# EAGLE design Naked Mega I-b (EAGLE 7.3.0)
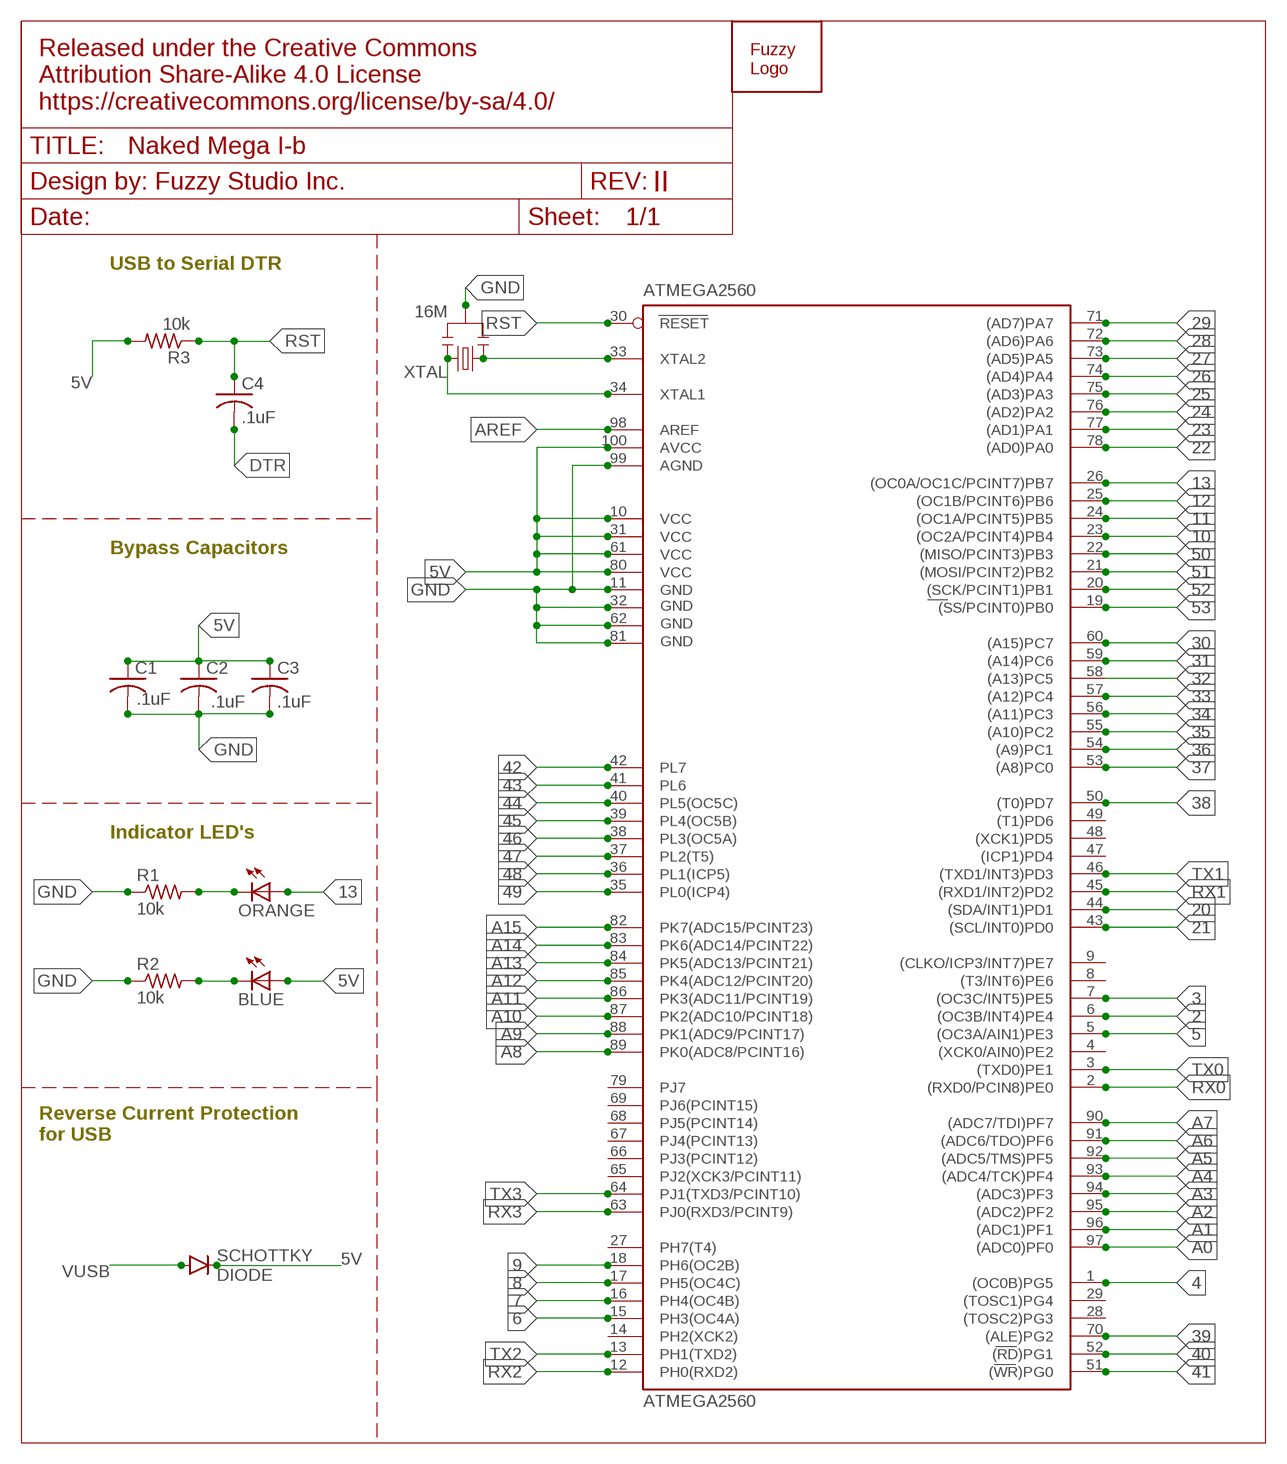
[diagram p0: schematic, sheet 1]

## Parts
ATMEGA2560  ATMEGA2560  [TQFP100]
BLUE  L  LED-SMD-0805  [SMD-0805-LED]
C1  CAPACITOR-SMD-0805  [SMD-0805]
C2  .1uF  CAPACITOR-SMD-0805  [SMD-0805]
C3  .1uF  CAPACITOR-SMD-0805  [SMD-0805]
C4  .1uF  CAPACITOR-SMD-0805  [SMD-0805]
ORANGE  L  LED-SMD-0805  [SMD-0805-LED]
R1  10k  RESISTOR-SMD-0805  [SMD-0805]
R2  10k  RESISTOR-SMD-0805  [SMD-0805]
R3  10k  RESISTOR-SMD-0805  [SMD-0805]
SCHOTTKY  DIODE  [SOD-323]
U$1  LOGO  [LOGO-S]
U$3  DOCFRAME  [CREATIVECOMMONS]
XTAL  16M  RESONATOR  [RESONATOR]

## Nets
2: ATMEGA2560.6((OC3B/INT4)PE4)
3: ATMEGA2560.7((OC3C/INT5)PE5)
4: ATMEGA2560.1((OC0B)PG5)
5: ATMEGA2560.5((OC3A/AIN1)PE3)
5V: ATMEGA2560.10(VCC) ATMEGA2560.31(VCC1) ATMEGA2560.61(VCC2) ATMEGA2560.80(VCC3) ATMEGA2560.100(AVCC) BLUE.1(A) C1.1 C2.1 C3.1 R3.2 SCHOTTKY.C
6: ATMEGA2560.15(PH3(OC4A))
7: ATMEGA2560.16(PH4(OC4B))
8: ATMEGA2560.17(PH5(OC4C))
9: ATMEGA2560.18(PH6(OC2B))
10: ATMEGA2560.23((OC2A/PCINT4)PB4)
11: ATMEGA2560.24((OC1A/PCINT5)PB5)
12: ATMEGA2560.25((OC1B/PCINT6)PB6)
13: ATMEGA2560.26((OC0A/OC1C/PCINT7)PB7) ORANGE.1(A)
20: ATMEGA2560.44((SDA/INT1)PD1)
21: ATMEGA2560.43((SCL/INT0)PD0)
22: ATMEGA2560.78((AD0)PA0)
23: ATMEGA2560.77((AD1)PA1)
24: ATMEGA2560.76((AD2)PA2)
25: ATMEGA2560.75((AD3)PA3)
26: ATMEGA2560.74((AD4)PA4)
27: ATMEGA2560.73((AD5)PA5)
28: ATMEGA2560.72((AD6)PA6)
29: ATMEGA2560.71((AD7)PA7)
30: ATMEGA2560.60((A15)PC7)
31: ATMEGA2560.59((A14)PC6)
32: ATMEGA2560.58((A13)PC5)
33: ATMEGA2560.57((A12)PC4)
34: ATMEGA2560.56((A11)PC3)
35: ATMEGA2560.55((A10)PC2)
36: ATMEGA2560.54((A9)PC1)
37: ATMEGA2560.53((A8)PC0)
38: ATMEGA2560.50((T0)PD7)
39: ATMEGA2560.70((ALE)PG2)
40: ATMEGA2560.52((RD)PG1)
41: ATMEGA2560.51((WR)PG0)
42: ATMEGA2560.42(PL7)
43: ATMEGA2560.41(PL6)
44: ATMEGA2560.40(PL5(OC5C))
45: ATMEGA2560.39(PL4(OC5B))
46: ATMEGA2560.38(PL3(OC5A))
47: ATMEGA2560.37(PL2(T5))
48: ATMEGA2560.36(PL1(ICP5))
49: ATMEGA2560.35(PL0(ICP4))
50: ATMEGA2560.22((MISO/PCINT3)PB3)
51: ATMEGA2560.21((MOSI/PCINT2)PB2)
52: ATMEGA2560.20((SCK/PCINT1)PB1)
53: ATMEGA2560.19((SS/PCINT0)PB0)
A0: ATMEGA2560.97((ADC0)PF0)
A1: ATMEGA2560.96((ADC1)PF1)
A2: ATMEGA2560.95((ADC2)PF2)
A3: ATMEGA2560.94((ADC3)PF3)
A4: ATMEGA2560.93((ADC4/TCK)PF4)
A5: ATMEGA2560.92((ADC5/TMS)PF5)
A6: ATMEGA2560.91((ADC6/TDO)PF6)
A7: ATMEGA2560.90((ADC7/TDI)PF7)
A8: ATMEGA2560.89(PK0(ADC8/PCINT16))
A9: ATMEGA2560.88(PK1(ADC9/PCINT17))
A10: ATMEGA2560.87(PK2(ADC10/PCINT18))
A11: ATMEGA2560.86(PK3(ADC11/PCINT19))
A12: ATMEGA2560.85(PK4(ADC12/PCINT20))
A13: ATMEGA2560.84(PK5(ADC13/PCINT21))
A14: ATMEGA2560.83(PK6(ADC14/PCINT22))
A15: ATMEGA2560.82(PK7(ADC15/PCINT23))
AREF: ATMEGA2560.98(AREF)
DTR: C4.2
GND: ATMEGA2560.11(GND) ATMEGA2560.32(GND1) ATMEGA2560.62(GND2) ATMEGA2560.81(GND3) ATMEGA2560.99(AGND) C1.2 C2.2 C3.2 R1.1 R2.1 XTAL.2
N$13: ATMEGA2560.34(XTAL1) XTAL.3
N$81: ATMEGA2560.33(XTAL2) XTAL.1
N$82: ORANGE.2(C) R1.2
N$83: BLUE.2(C) R2.2
RST: ATMEGA2560.30(RESET) C4.1 R3.1
RX0: ATMEGA2560.2((RXD0/PCIN8)PE0)
RX1: ATMEGA2560.45((RXD1/INT2)PD2)
RX2: ATMEGA2560.12(PH0(RXD2))
RX3: ATMEGA2560.63(PJ0(RXD3/PCINT9))
TX0: ATMEGA2560.3((TXD0)PE1)
TX1: ATMEGA2560.46((TXD1/INT3)PD3)
TX2: ATMEGA2560.13(PH1(TXD2))
TX3: ATMEGA2560.64(PJ1(TXD3/PCINT10))
VUSB: SCHOTTKY.A
Unconnected: ATMEGA2560.4((XCK0/AIN0)PE2) ATMEGA2560.8((T3/INT6)PE6) ATMEGA2560.9((CLKO/ICP3/INT7)PE7) ATMEGA2560.14(PH2(XCK2)) ATMEGA2560.27(PH7(T4)) ATMEGA2560.28((TOSC2)PG3) ATMEGA2560.29((TOSC1)PG4) ATMEGA2560.47((ICP1)PD4) ATMEGA2560.48((XCK1)PD5) ATMEGA2560.49((T1)PD6) ATMEGA2560.65(PJ2(XCK3/PCINT11)) ATMEGA2560.66(PJ3(PCINT12)) ATMEGA2560.67(PJ4(PCINT13)) ATMEGA2560.68(PJ5(PCINT14)) ATMEGA2560.69(PJ6(PCINT15)) ATMEGA2560.79(PJ7)

## Notes on the sheet
- II
- USB to Serial DTR
- Bypass Capacitors
- .1uF
- Indicator LED's
- Reverse Current Protection
  for USB

## Library data of the parts
ATMEGA2560 = Fuzzy:ATMEGA2560
BLUE ORANGE = Fuzzy:LED-SMD-0805
C1-C4 = Fuzzy:CAPACITOR-SMD-0805
R1-R3 = Fuzzy:RESISTOR-SMD-0805
SCHOTTKY = Fuzzy:DIODE
U$1 = Fuzzy:LOGO
U$3 = Fuzzy:DOCFRAME
XTAL = Fuzzy:RESONATOR

## Board
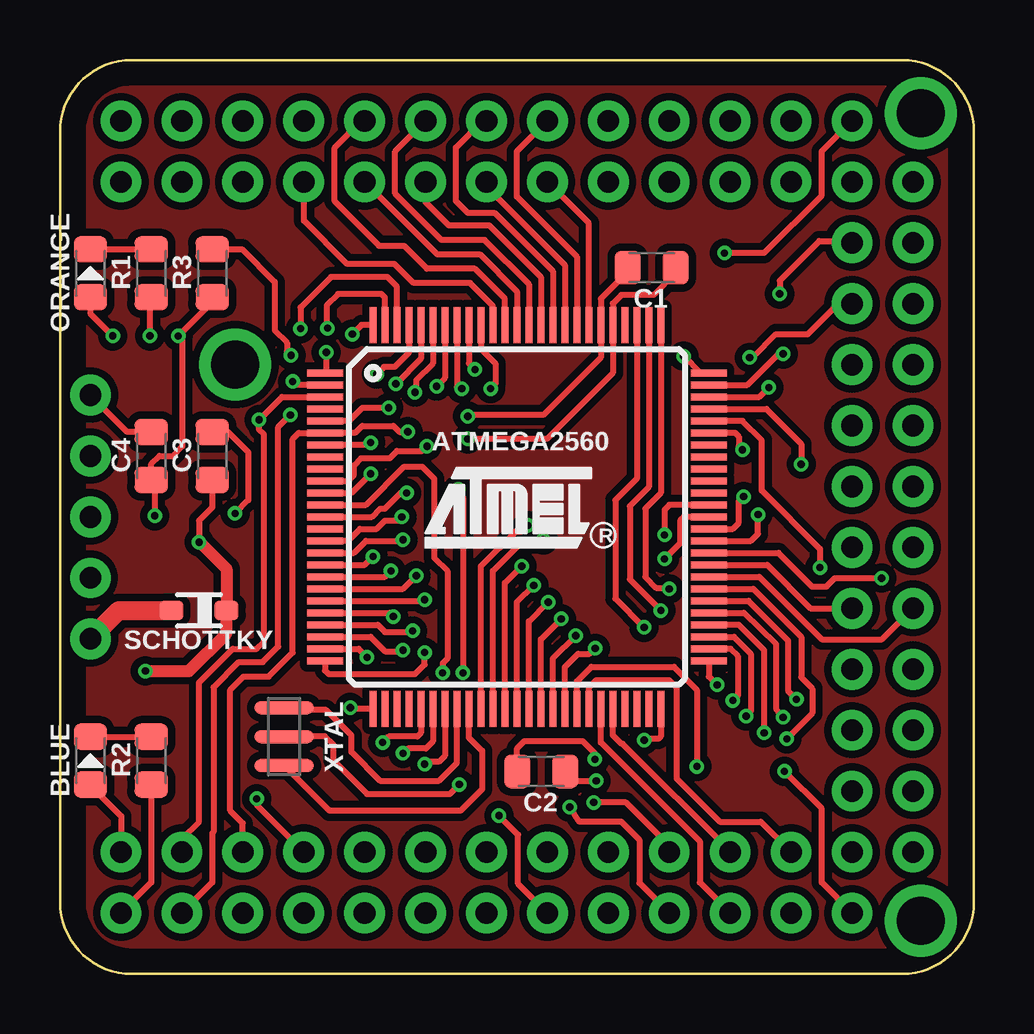
[diagram p1: board, top side]
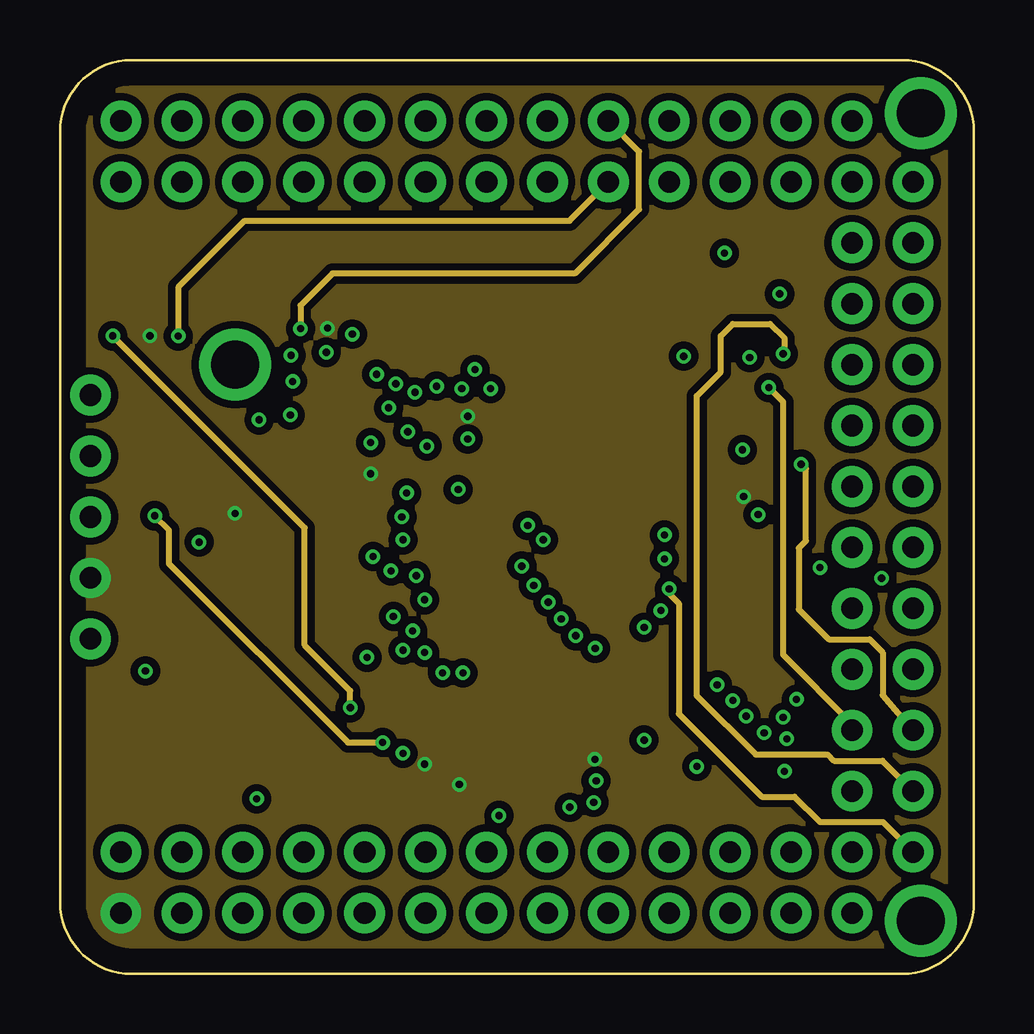
[diagram p2: board, inner layer Route2]
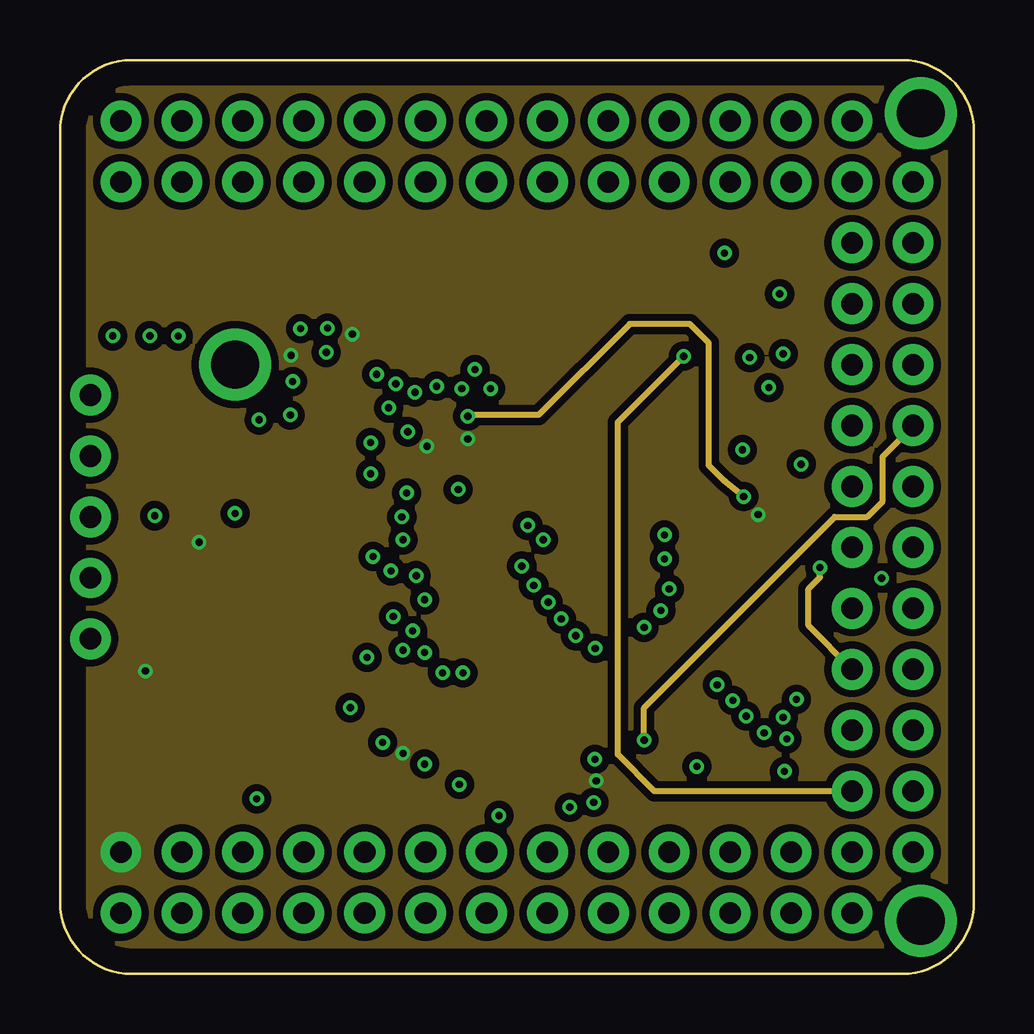
[diagram p3: board, inner layer Route15]
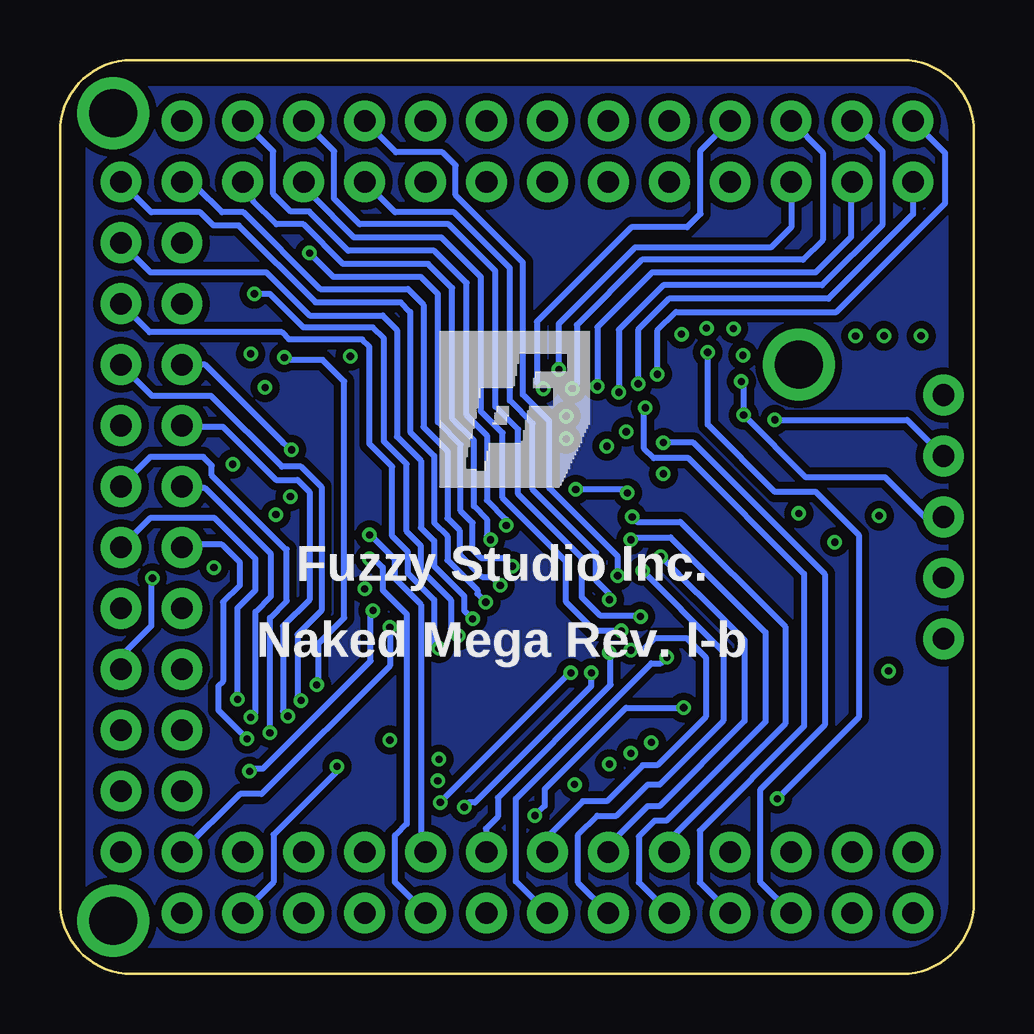
[diagram p4: board, bottom side, seen from below]

Size 38.1 x 38.1 mm. Coordinates in mm from the lower left corner, seen from the top.
Outline: 35.1,38.1 3,38.1 arc90 0,35.1 0,3 arc90 3,0 35.1,0 arc90 38.1,3 38.1,35.1 arc90 35.1,38.1
Copper layers (1*2*15*16): Top 0.035mm / dielectric 0.3mm / Route2 0.035mm / dielectric 0.3mm / Route15 0.035mm / dielectric 0.3mm / Bottom 0.035mm
Design rules "Fuzzy *": minimum track width 0.25mm, minimum drill 0.3mm, track to track 6mil, track to pad 6mil, pad to pad 6mil, via to via 6mil, smd to smd 6mil, copper to edge 40mil, drill to drill 8mil, minimum pad ring 6mil, minimum via ring 6mil, stop-mask expansion 4mil, vias tented up to drill 0.5mm, thermal gap 10mil

### Footprints (pad centres in the part's own frame; a part is rotated, then mirrored left to right if it is on the bottom)
TQFP100 = smd 1.5 x 0.3: 1 -8,6; 2 -8,5.5; 3 -8,5; 4 -8,4.5; 5 -8,4; 6 -8,3.5; 7 -8,3; 8 -8,2.5; 9 -8,2; 10 -8,1.5; 11 -8,1; 12 -8,0.5; 13 -8,0; 14 -8,-0.5; 15 -8,-1; 16 -8,-1.5; 17 -8,-2; 18 -8,-2.5; 19 -8,-3; 20 -8,-3.5; 21 -8,-4; 22 -8,-4.5; 23 -8,-5; 24 -8,-5.5; 25 -8,-6; 51 8,-6; 52 8,-5.5; 53 8,-5; 54 8,-4.5; 55 8,-4; 56 8,-3.5; 57 8,-3; 58 8,-2.5; 59 8,-2; 60 8,-1.5; 61 8,-1; 62 8,-0.5; 63 8,0; 64 8,0.5; 65 8,1; 66 8,1.5; 67 8,2; 68 8,2.5; 69 8,3; 70 8,3.5; 71 8,4; 72 8,4.5; 73 8,5; 74 8,5.5; 75 8,6 | smd 0.3 x 1.5: 26 -6,-8; 27 -5.5,-8; 28 -5,-8; 29 -4.5,-8; 30 -4,-8; 31 -3.5,-8; 32 -3,-8; 33 -2.5,-8; 34 -2,-8; 35 -1.5,-8; 36 -1,-8; 37 -0.5,-8; 38 0,-8; 39 0.5,-8; 40 1,-8; 41 1.5,-8; 42 2,-8; 43 2.5,-8; 44 3,-8; 45 3.5,-8; 46 4,-8; 47 4.5,-8; 48 5,-8; 49 5.5,-8; 50 6,-8; 76 6,8; 77 5.5,8; 78 5,8; 79 4.5,8; 80 4,8; 81 3.5,8; 82 3,8; 83 2.5,8; 84 2,8; 85 1.5,8; 86 1,8; 87 0.5,8; 88 0,8; 89 -0.5,8; 90 -1,8; 91 -1.5,8; 92 -2,8; 93 -2.5,8; 94 -3,8; 95 -3.5,8; 96 -4,8; 97 -4.5,8; 98 -5,8; 99 -5.5,8; 100 -6,8
SMD-0805-LED = smd 1.1 x 1.4: 1 -1,0; 2 1,0
SMD-0805 = smd 1.1 x 1.4: 1 -1,0; 2 1,0
SOD-323 = smd 1 x 0.8: A 1.15,0; C -1.15,0
RESONATOR = smd 0.55 x 2.5: 1 -1.2,0; 2 0,0; 3 1.2,0

### Placement (x,y rotation side)
ATMEGA2560  19.05,19.05 0 top
BLUE  1.27,8.89 90 top
C1  24.66,29.45 180 top
C2  20.06,8.44 180 top
C3  6.35,21.59 90 top
C4  3.81,21.59 90 top
ORANGE  1.27,29.21 90 top
R1  3.81,29.21 90 top
R2  3.81,8.89 90 top
R3  6.35,29.21 90 top
SCHOTTKY  5.79,15.15 180 top
U$1  22.23,20.32 0 bottom
U$3  16.5,-7 0 top  (outside the outline)
XTAL  9.34,9.89 270 top

### Tracks (layer width: path | path; a pad name or v marks a point on that pad's centre or on a via)
2  (via drill 0.3 pad 0.5, 0.9 pad 1.7)
  Top 0.25: v7.62,5.08 7.62,6.28 7.1,6.8 7.1,11.85 7.65,12.4 8.7,12.4 9.7,13.4 9.7,22.3 9.95,22.55 ATMEGA2560.6 12.3,22.55 12.6,22.85 13.9,22.85 14.15,22.6 v14.5,22.6
3  (via drill 0.3 pad 0.5, 0.9 pad 1.7)
  Top 0.25: ATMEGA2560.7 12.85,22.05 v12.95,22.15
  Bottom 0.25: 12.85,22.05 v12.95,22.15 11.7,22.15 6.22,16.67 6.22,10.38 8.9,7.7 8.9,3.82 v7.62,2.54
4  (via drill 0.3 pad 0.5, 0.9 pad 1.7)
  Top 0.25: v11.1,25.91 11.1,25.1 ATMEGA2560.1 | v8.2,7.3 8.2,7.04 v10.16,5.08
  Bottom 0.25: v11.1,25.91 11.1,22.9 8.3,20.1 6.6,20.1 4.8,18.3 4.8,10.7 v8.2,7.3
5  (via drill 0.3 pad 0.5, 0.9 pad 1.7)
  Top 0.25: v13.7,23.6 12.6,23.6 12.05,23.05 ATMEGA2560.5
  Bottom 0.25: 13.7,23.45 v13.7,23.6 13.75,23.55 13.75,21.9 13.35,21.5 11.9,21.5 7.08,16.68 7.08,10.32 11.43,5.97 11.43,3.81 v10.16,2.54
5V  (via drill 0.3 pad 0.5, 0.9 pad 1.7)
  Top 0.25: ATMEGA2560.31 15.55,9.7 15.25,9.4 14.5,9.4 v14.3,9.2 | v17,22.3 20.3,22.3 23.05,25.05 ATMEGA2560.80 23.05,27.95 23.4,28.3 24.75,28.3 25.66,29.21 C1.1 | ATMEGA2560.61 28.8,18.05 29.1,18.35 v29.1,19.15 | ATMEGA2560.10 12,20.55 12.25,20.8 12.25,21.2 12.55,21.5 13.75,21.5 14.05,21.8 15.1,21.8 v15.3,22 | R3.2 7.59,30.21 8.95,28.85 8.95,26.82 9.46,26.31 9.46,25.96 v9.63,25.79 | C3.1 6.35,19.45 5.8,18.9 v5.8,18 | C2.1 21.06,8.1 21.11,8.05 v22.35,8.05 | ATMEGA2560.100 12.57,27.05 v12.19,26.67 | BLUE.1 1.27,7.86 2.56,6.57 2.56,5.1 v2.54,5.08
  Top 0.5: 5.82,18.01 6.94,16.89 SCHOTTKY.C 6.94,14.2 5.37,12.63 v3.56,12.63
  pour Route15 (isolate 0.305): 0,35.1 0,3 arc90 3,0 35.1,0 arc90 38.1,3 38.1,35.1 arc90 35.1,38.1 3,38.1 arc90
6  (via drill 0.3 pad 0.5, 0.9 pad 1.7)
  Top 0.25: v14.25,19.05 14.1,18.9 13.55,18.9 13.2,18.55 12.5,18.55 12,18.05 ATMEGA2560.15
  Bottom 0.25: v12.7,5.08 12.7,5.6 7.87,10.43 7.87,14.48 12.24,18.85 14.05,18.85 v14.25,19.05
7  (via drill 0.3 pad 0.5, 0.9 pad 1.7)
  Top 0.25: ATMEGA2560.16 12.25,17.55 12.75,18.05 14.25,18.05 v14.3,18.1
  Bottom 0.25: v14.3,18.1 14.2,18.2 12.65,18.2 8.69,14.24 8.69,10.51 12.8,6.4 13.3,6.4 13.97,5.73 13.97,3.81 v12.7,2.54
8  (via drill 0.3 pad 0.5, 0.9 pad 1.7)
  Top 0.25: ATMEGA2560.17 12.7,17.05 v13.05,17.4
  Bottom 0.25: v15.24,5.08 15.24,5.36 13.6,7 13.1,7 9.56,10.54 9.56,13.92 11.53,15.89 11.54,15.89 v13.05,17.4
9  (via drill 0.3 pad 0.5, 0.9 pad 1.7)
  Top 0.25: ATMEGA2560.18 13.55,16.55 v13.8,16.8
  Bottom 0.25: v13.8,16.8 12.2,15.2 12.2,15.18 10.45,13.43 10.45,10.55 13.1,7.9 13.6,7.9 14.9,6.6 15.7,6.6 16.5,5.8 16.5,3.8 v15.24,2.54
10  (via drill 0.3 pad 0.5, 0.9 pad 1.7)
  Top 0.25: ATMEGA2560.23 12.95,14.05 13.55,13.45 14.25,13.45 v14.3,13.5
  Bottom 0.25: v14.3,13.5 13.8,13.5 13.3,14 11.98,14 11.18,13.2 11.18,10.72 13.2,8.7 13.8,8.7 15.3,7.2 16.3,7.2 17.8,5.7 17.8,5.1 v17.78,5.08
11  (via drill 0.3 pad 0.5, 0.9 pad 1.7)
  Top 0.25: ATMEGA2560.24 12.45,13.55 v12.8,13.2 12.75,13.15
  Bottom 0.25: v12.8,13.2 13.05,12.95 13.45,12.95 19.1,7.3 19.1,3.86 v17.78,2.54
12  (via drill 0.3 pad 0.5, 0.9 pad 1.7)
  Top 0.25: ATMEGA2560.25 11.05,12.65 11.2,12.5 14.8,12.5 15.2,12.9 v15.2,13.4
  Bottom 0.25: v15.2,13.4 15.15,13.35 15.15,12.05 19.85,7.35 19.85,6.55 20.35,6.05 20.35,5.11 v20.32,5.08
13  (via drill 0.3 pad 0.5, 0.9 pad 1.7)
  Top 0.25: v20.32,2.54 19.1,3.76 19.1,5.8 v18.3,6.6 | ORANGE.1 1.27,27.53 v2.2,26.6 | ATMEGA2560.26 12.15,11.05 v12.1,11.1
  Route2 0.25: v12.1,11.1 12.1,11.8 10.2,13.7 10.2,18.6 v2.2,26.6
  Bottom 0.25: 12.2,11.2 v12.1,11.1 14.5,11.1 17.9,7.7 17.9,7 v18.3,6.6
20  (via drill 0.9 pad 1.7)
  Top 0.25: ATMEGA2560.44 22.05,11.95 22.35,12.25 25.4,12.25 25.7,11.95 25.7,8.15 27.5,6.35 29.21,6.35 v30.48,5.08
21  (via drill 0.3 pad 0.5, 0.9 pad 1.7)
  Top 0.25: ATMEGA2560.43 21.55,12.2 22.15,12.8 25.6,12.8 26.55,11.85 v26.55,8.65
  Bottom 0.25: v26.55,8.65 26.55,8.45 29.2,5.8 29.2,3.82 v30.48,2.54
22  (via drill 0.3 pad 0.5, 0.9 pad 1.7)
  Top 0.25: ATMEGA2560.78 24.05,20.65 23.15,19.75 23.15,15.65 v24.35,14.45
  Bottom 0.25: v24.35,14.45 24.35,12.85 29.7,7.5 30.6,7.5 v33.02,5.08
23  (via drill 0.3 pad 0.5, 0.9 pad 1.7)
  Top 0.25: ATMEGA2560.77 24.55,20.3 23.75,19.5 23.75,16.45 v25.05,15.15 | v33.02,2.54 31.75,3.81 31.75,6.9 v30.2,8.45
  Bottom 0.25: v25.05,15.15 25.15,15.05 25.15,13.05 29.65,8.55 30.1,8.55 v30.2,8.45
24  (via drill 0.3 pad 0.5, 0.9 pad 1.7)
  Top 0.25: ATMEGA2560.76 25.05,20.05 24.4,19.4 24.4,16.55 24.85,16.1 25.35,16.1 v25.4,16.05
  Route2 0.25: v25.4,16.05 25.4,15.85 25.8,15.45 25.8,10.85 29.26,7.39 30.62,7.39 31.68,6.33 34.31,6.33 v35.56,5.08 35.52,5.08
25  (via drill 0.3 pad 0.5, 0.9 pad 1.7)
  Top 0.25: ATMEGA2560.75 26.7,25.05 v26,25.75
  Route15 0.25: v33.02,7.62 24.78,7.62 23.25,9.15 23.25,23 v26,25.75
26  (via drill 0.3 pad 0.5, 0.9 pad 1.7)
  Top 0.25: ATMEGA2560.74 28.65,24.55 29.95,25.85 v30.15,25.85
  Route2 0.25: v35.56,7.62 34.29,8.89 32.27,8.89 32.01,9.15 29,9.15 26.55,11.6 26.55,24.1 27.55,25.1 27.55,26.6 28.05,27.1 29.6,27.1 30.2,26.5 30.2,25.9 v30.15,25.85
27  (via drill 0.3 pad 0.5, 0.9 pad 1.7)
  Top 0.25: ATMEGA2560.73 29.15,24.05 v29.55,24.45
  Route2 0.25: v29.55,24.45 30.15,23.85 30.15,13.3 33.02,10.43 v33.02,10.16
28  (via drill 0.3 pad 0.5, 0.9 pad 1.7)
  Top 0.25: ATMEGA2560.72 29.45,23.55 30.9,22.1 v30.9,21.25
  Route2 0.25: v35.56,10.16 34.3,11.62 34.3,13.4 33.75,13.95 32.05,13.95 30.8,15.2 30.8,17.75 31.1,18.05 31.1,21.05 v30.9,21.25
29  (via drill 0.3 pad 0.5, 0.9 pad 1.7)
  Top 0.25: ATMEGA2560.71 28.45,23.05 29.25,22.25 29.25,20.15 31.68,17.72 v31.68,16.94
  Route15 0.25: v33.02,12.7 31.2,14.52 31.2,16.05 31.68,16.53 v31.68,16.94
30  (via drill 0.3 pad 0.5, 0.9 pad 1.7)
  Top 0.25: 34.2,16.45 v34.25,16.5 32.3,16.5 31.95,16.15 31.35,16.15 29.95,17.55 ATMEGA2560.60
  Bottom 0.25: v35.56,12.7 35.56,13.24 34.28,14.52 34.28,16.47 v34.25,16.5
31  (via drill 0.9 pad 1.7)
  Top 0.25: 32.98,15.2 v33.02,15.24 31.29,15.24 29.48,17.05 ATMEGA2560.59
32  (via drill 0.9 pad 1.7)
  Top 0.25: ATMEGA2560.58 29.15,16.55 31.75,13.95 34.27,13.95 v35.56,15.24
33  (via drill 0.3 pad 0.5, 0.9 pad 1.7)
  Top 0.25: ATMEGA2560.57 28.9,16.05 30.9,14.05 30.9,12.37 31.36,11.9 31.36,10.86 v30.3,9.8
  Bottom 0.25: v33.02,17.78 32.9,17.9 31.35,17.9 30.6,17.15 30.6,16.2 31.3,15.5 31.3,12.2 31.5,12 31.5,11 v30.3,9.8
34  (via drill 0.3 pad 0.5, 0.9 pad 1.7)
  Top 0.25: ATMEGA2560.56 28.7,15.55 30.35,13.9 30.35,11.8 v30.7,11.45 30.65,11.5
  Bottom 0.25: v30.7,11.45 30.7,15.25 29.95,16 29.95,17.3 31.65,19 34.34,19 v35.56,17.78
35  (via drill 0.3 pad 0.5, 0.9 pad 1.7)
  Top 0.25: ATMEGA2560.55 28.5,15.05 29.85,13.75 29.85,11.05 v30.15,10.7
  Bottom 0.25: v33.02,20.32 32.95,20.25 32.05,20.25 29.3,17.5 29.3,15.75 29.95,15.1 29.95,10.9 v30.15,10.7
36  (via drill 0.3 pad 0.5, 0.9 pad 1.7)
  Top 0.25: v29.35,10.05 29.35,13.5 28.3,14.55 ATMEGA2560.54
  Bottom 0.25: v29.35,10.05 29.35,14.85 28.65,15.55 28.65,17.7 28.69,17.7 31.77,20.78 31.77,21.19 32.13,21.55 34.33,21.55 v35.56,20.32
37  (via drill 0.3 pad 0.5, 0.9 pad 1.7)
  Top 0.25: ATMEGA2560.53 28.1,14.05 28.8,13.35 28.8,10.95 v28.6,10.75
  Bottom 0.25: v33.02,22.86 32.96,22.8 31.3,22.8 29.1,20.6 28.2,20.6 27.7,20.1 27.7,15.6 28.8,14.5 28.8,10.95 v28.6,10.75
38  (via drill 0.3 pad 0.5, 0.9 pad 1.7)
  Top 0.25: ATMEGA2560.50 25.05,9.9 24.95,9.8 24.4,9.8 v24.35,9.75
  Route15 0.25: v24.35,9.75 24.35,11.1 32.3,19.05 33.65,19.05 34.3,19.7 34.3,21.56 35.56,22.82 v35.56,22.86
39  (via drill 0.3 pad 0.5, 0.9 pad 1.7)
  Top 0.25: v28.45,21.85 28.3,22 28.3,22.4 28.15,22.55 ATMEGA2560.70
  Bottom 0.25: v28.45,21.85 28.8,22.15 32.05,25.4 v33.02,25.4
40  (via drill 0.3 pad 0.5, 0.9 pad 1.7)
  Top 0.25: v28.05,11.4 28.25,11.6 28.25,13.25 27.95,13.55 ATMEGA2560.52
  Bottom 0.25: v35.56,25.4 34.26,24.1 31.8,24.1 28.85,21.15 28.05,21.15 27.2,20.3 27.2,15.15 28.2,14.15 28.2,11.55 v28.05,11.4
41  (via drill 0.3 pad 0.5, 0.9 pad 1.7)
  Top 0.25: ATMEGA2560.51 27.05,12.4 v27.4,12.05 | v33.02,27.94 32.44,27.94 31.17,26.67 29.84,26.67 28.88,25.7 v28.75,25.7
  Bottom 0.25: v27.4,12.05 27.35,12.1 27.35,13.75 26.25,14.85 26.25,24.7 27.15,25.6 28.65,25.6 v28.75,25.7
42  (via drill 0.3 pad 0.5, 0.9 pad 1.7)
  Top 0.25: ATMEGA2560.42 21.05,12.79 21.6,13.34 22.08,13.34 v22.31,13.57
  Bottom 0.25: v35.56,27.94 34.37,26.75 28.85,26.75 28.55,26.45 25.5,26.45 25.2,26.15 25.2,22.1 24.25,21.15 24.25,18.25 23.6,17.6 23.6,16.7 22.5,15.6 22.5,13.76 v22.31,13.57
43  (via drill 0.3 pad 0.5, 0.9 pad 1.7)
  Top 0.25: ATMEGA2560.41 20.55,13.15 v21.5,14.1 21.45,14.05 | v33.02,30.48 32.95,30.55 31.65,30.55 30,28.9 v30,28.35
  Bottom 0.25: v30,28.35 29.35,28.35 27.95,26.95 25.05,26.95 24.6,26.5 24.6,22.2 23.65,21.25 23.65,18.45 23.05,17.85 23.05,16.85 21.8,15.6 21.8,14.4 v21.5,14.1
44  (via drill 0.3 pad 0.5, 0.9 pad 1.7)
  Top 0.25: ATMEGA2560.40 20.05,13.95 v20.9,14.8 20.85,14.75
  Bottom 0.25: v20.9,14.8 21.25,15.15 21.25,15.75 22.5,17 22.5,18.05 23.05,18.6 23.05,21.4 24.05,22.4 24.05,26.85 24.65,27.45 27.7,27.45 29.5,29.25 34.33,29.25 v35.56,30.48
45  (via drill 0.3 pad 0.5, 0.9 pad 1.7)
  Top 0.25: ATMEGA2560.39 19.55,14.7 v20.35,15.5
  Bottom 0.25: v35.56,33.02 34.29,31.75 32.25,31.75 31.7,31.2 30.65,31.2 27.45,28 23.9,28 23.5,27.6 23.5,22.6 22.5,21.6 22.5,18.8 21.95,18.25 21.95,17.25 20.7,16 20.7,15.85 v20.35,15.5
46  (via drill 0.3 pad 0.5, 0.9 pad 1.7)
  Top 0.25: ATMEGA2560.38 19.05,15.5 v19.75,16.2
  Bottom 0.25: 32.9,32.9 v33.02,33.02 32.8,32.8 32.4,32.8 31.35,31.75 30.45,31.75 27.25,28.55 23.6,28.55 22.95,27.9 22.95,22.8 21.95,21.8 21.95,19 21.45,18.5 21.45,17.5 20.5,16.55 20.1,16.55 v19.75,16.2
47  (via drill 0.3 pad 0.5, 0.9 pad 1.7)
  Top 0.25: ATMEGA2560.37 18.55,16.3 v19.25,17 | v33.02,35.56 31.75,34.29 31.75,32.45 29.35,30.05 v27.7,30.05
  Bottom 0.25: v27.7,30.05 26.7,29.05 23.05,29.05 22.35,28.35 22.35,23 21.4,22.05 21.4,19.3 20.9,18.8 20.9,17.7 20.55,17.35 19.6,17.35 v19.25,17
48  (via drill 0.3 pad 0.5, 0.9 pad 1.7)
  Top 0.25: ATMEGA2560.36 18.05,16.8 19.2,17.95 20,17.95 v20.15,18.1
  Bottom 0.25: v20.15,18.1 20.3,18.25 20.3,18.95 20.85,19.5 20.85,22.25 21.75,23.15 21.75,28.6 22.75,29.6 26.3,29.6 27.95,31.25 29.07,31.25 30.06,32.24 30.06,32.6 v30.48,33.02
49  (via drill 0.3 pad 0.5, 0.9 pad 1.7)
  Top 0.25: ATMEGA2560.35 17.55,17 19,18.45 19.25,18.45 v19.5,18.7
  Bottom 0.25: v19.5,18.7 19.5,18.95 20.3,19.75 20.3,22.45 21.15,23.3 21.15,28.8 22.5,30.15 26.08,30.15 27.71,31.78 28.48,31.78 29.21,32.51 29.21,34.29 v30.48,35.56
50  (via drill 0.3 pad 0.5, 0.9 pad 1.7)
  Top 0.25: ATMEGA2560.22 13.25,14.55 13.55,14.25 14.65,14.25 v14.7,14.3
  Bottom 0.25: v14.7,14.3 15.8,14.3 17,15.5 17,17.2 19.65,19.85 19.65,22.55 20.55,23.45 20.55,29.05 22.2,30.7 25.84,30.7 27.64,32.5 27.64,32.72 v27.94,33.02
51  (via drill 0.3 pad 0.5, 0.9 pad 1.7)
  Top 0.25: 13.8,15 v13.9,14.9 13.75,15.05 ATMEGA2560.21
  Bottom 0.25: 27.94,35.54 v27.94,35.56 26.67,34.29 26.68,34.28 26.68,32.32 25.61,31.25 21.9,31.25 19.95,29.3 19.95,23.65 19,22.7 19,20 16.35,17.35 16.35,15.7 15.6,14.95 13.95,14.95 v13.9,14.9
52  (via drill 0.3 pad 0.5, 0.9 pad 1.7)
  Top 0.25: 15.1,15.5 v15.2,15.6 15.15,15.55 ATMEGA2560.20
  Bottom 0.25: v15.2,15.6 15.2,15.85 15.75,16.4 15.75,17.55 18.4,20.2 18.4,22.95 19.35,23.9 19.35,29.43 21.67,31.75 24.13,31.75 v25.4,33.02
53  (via drill 0.3 pad 0.5, 0.9 pad 1.7)
  Top 0.25: ATMEGA2560.19 14.3,16.05 v14.85,16.6
  Bottom 0.25: v14.85,16.6 14.85,17.4 17.7,20.25 17.7,23.05 18.8,24.15 18.8,29.66 21.61,32.47 21.61,33.71 22.15,34.25 24.09,34.25 v25.4,35.56
A0  (via drill 0.3 pad 0.5, 0.9 pad 1.7)
  Top 0.25: ATMEGA2560.97 14.55,25.9 13.95,25.3 13.5,25.3 v13.2,25
  Bottom 0.25: v2.54,35.56 1.2,34.22 1.2,32.13 5.73,27.6 12.42,27.6 13.21,26.81 v13.21,25.01 v13.2,25
A1  (via drill 0.3 pad 0.5, 0.9 pad 1.7)
  Top 0.25: ATMEGA2560.96 15.05,25.65 v14,24.6
  Bottom 0.25: v2.54,33.02 2.54,31.67 6.06,28.15 12.71,28.15 14,26.86 v14,24.6 v14.01,24.61
A2  (via drill 0.3 pad 0.5, 0.9 pad 1.7)
  Top 0.25: ATMEGA2560.95 15.55,25.45 14.85,24.75 14.85,24.3 v14.8,24.25
  Bottom 0.25: v5.08,35.56 3.8,34.28 3.8,31.24 6.33,28.71 12.95,28.71 14.8,26.86 v14.8,24.25
A3  (via drill 0.3 pad 0.5, 0.9 pad 1.7)
  Top 0.25: ATMEGA2560.94 16.05,24.85 v15.7,24.5
  Bottom 0.25: v5.08,33.02 5.13,32.97 5.13,30.72 6.61,29.24 13.42,29.24 15.7,26.96 v15.7,24.5
A4  (via drill 0.3 pad 0.5, 0.9 pad 1.7)
  Top 0.25: ATMEGA2560.93 16.55,24.45 v16.75,24.4
  Bottom 0.25: v7.62,35.56 6.3,34.24 6.3,30.6 7.13,29.77 13.83,29.77 ATMEGA2560.93 16.55,24.6 v16.75,24.4
A5  (via drill 0.3 pad 0.5, 0.9 pad 1.7)
  Top 0.25: 17.1,25.4 v17.3,25.2 17.05,25.45 ATMEGA2560.92
  Bottom 0.25: v7.62,33.02 7.62,31.13 8.47,30.28 14.13,30.28 17.3,27.11 v17.3,25.2
A6  (via drill 0.3 pad 0.5, 0.9 pad 1.7)
  Top 0.25: v17.95,24.4 18.15,24.6 18.15,25.45 17.55,26.05 ATMEGA2560.91
  Bottom 0.25: v10.16,35.56 11.4,34.32 11.4,31.69 11.96,31.13 14.28,31.13 18.22,27.19 18.22,24.67 v17.95,24.4
A7  (via drill 0.9 pad 1.7)
  Top 0.25: ATMEGA2560.90 18.05,27.85 17.1,28.8 14.74,28.8 13.94,29.6 11.97,29.6 10.17,31.4 v10.17,33.01 v10.16,33.02
A8  (via drill 0.9 pad 1.7)
  Top 0.25: ATMEGA2560.89 18.55,28.15 17.3,29.4 15.3,29.4 14.34,30.36 13.3,30.36 11.45,32.21 11.45,34.45 12.56,35.56 v12.7,35.56
A9  (via drill 0.9 pad 1.7)
  Top 0.25: v12.7,33.02 15.72,30 17.5,30 19.05,28.45 ATMEGA2560.88
A10  (via drill 0.9 pad 1.7)
  Top 0.25: v15.24,35.56 13.97,34.29 13.97,32.53 15.9,30.6 17.7,30.6 19.55,28.75 ATMEGA2560.87
A11  (via drill 0.9 pad 1.7)
  Top 0.25: ATMEGA2560.86 20.05,29.05 17.9,31.2 16.21,31.2 15.25,32.16 v15.25,33.01 v15.24,33.02
A12  (via drill 0.9 pad 1.7)
  Top 0.25: v17.78,35.56 17.61,35.56 16.5,34.45 16.5,32.22 16.99,31.73 18.11,31.73 20.55,29.29 ATMEGA2560.85
A13  (via drill 0.9 pad 1.7)
  Top 0.25: v17.78,33.02 18.1,32.7 18.1,32.5 21.05,29.55 ATMEGA2560.84
A14  (via drill 0.9 pad 1.7)
  Top 0.25: v20.32,35.56 19.05,34.29 19.05,32.4 21.55,29.9 ATMEGA2560.83
A15  (via drill 0.9 pad 1.7)
  Top 0.25: ATMEGA2560.82 22.05,31.29 v20.32,33.02
AREF  (via drill 0.3 pad 0.5, 0.9 pad 1.7)
  Top 0.25: ATMEGA2560.98 14.05,28.65 13.65,29.05 11.3,29.05 10.03,27.78 v10.03,26.91 v10.03,26.9
  Route2 0.25: v22.86,35.56 24.14,34.28 24.14,31.88 21.46,29.2 11.36,29.2 10.03,27.87 v10.03,26.91 v10.03,26.9
DTR  (via drill 0.9 pad 1.7)
  Top 0.25: C4.2 2.81,22.59 v1.27,24.13
GND  (via drill 0.3 pad 0.5, 0.9 pad 1.68, 0.9 pad 1.7)
  Top 0.25: ATMEGA2560.32 16.05,9.1 15.8,8.85 15.3,8.85 v15.2,8.75 | ATMEGA2560.99 13.55,28.2 13.4,28.35 11.59,28.35 11.12,27.88 11.12,26.95 v11.15,26.92 | v3.75,26.6 3.75,28.15 R1.1 3.96,28.21 | v17,23.25 17.05,23.3 20.15,23.3 22.55,25.7 ATMEGA2560.81 22.55,28.15 23.66,29.27 C1.2 | ATMEGA2560.62 28.05,18.55 28.3,18.8 28.3,19.7 v28.5,19.9 | R2.1 3.81,3.81 v2.54,2.54 | ATMEGA2560.11 12.15,20.05 v12.95,20.85 | v16.65,7.9 16.25,7.5 12.8,7.5 11.4,8.9 11.4,9.56 11.05,9.91 9.36,9.91 XTAL.2 | C3.2 7.01,22.59 7.85,21.75 7.85,19.75 v7.3,19.2 | C2.2 19.06,9.41 19.35,9.7 21.8,9.7 22.3,9.2 v22.3,8.95
  Route15 0.25: v28.5,19.9 27.7,20.55 27.05,21.2 27.05,26.3 26.25,27.1 23.75,27.1 19.95,23.3 17.05,23.3 v17,23.25
  other vias: 1.27,16.51
  pour Route2 (isolate 0.305): 0,35.1 0,3 arc90 3,0 35.1,0 arc90 38.1,3 38.1,35.1 arc90 35.1,38.1 3,38.1 arc90
GND2
  pour Top (isolate 0.305): 0,35.1 0,3 arc90 3,0 35.1,0 arc90 38.1,3 38.1,35.1 arc90 35.1,38.1 3,38.1 arc90
GND3
  pour Bottom (isolate 0.305): 0,35.1 0,3 arc90 3,0 35.1,0 arc90 38.1,3 38.1,35.1 arc90 35.1,38.1 3,38.1 arc90
N$1  (via drill 2 pad 2.8)
  other vias: 35.88,35.88
N$2  (via drill 2 pad 2.8)
  other vias: 35.88,2.22
N$3  (via drill 2 pad 2.8)
  other vias: 7.3,25.4
N$13
  Top 0.25: XTAL.3 11.23,6.8 16.7,6.8 17.6,7.7 17.6,9.3 17.05,9.85 ATMEGA2560.34
N$81
  Top 0.25: XTAL.1 9.43,11 11.1,11 12.15,9.95 12.15,9.25 13.35,8.05 15.8,8.05 16.55,8.8 ATMEGA2560.33
N$82
  Top 0.25: ORANGE.2 R1.2
N$83
  Top 0.25: BLUE.2 R2.2
RST  (via drill 0.3 pad 0.5, 0.9 pad 1.7)
  Top 0.25: ATMEGA2560.30 15.05,10.05 14.9,9.9 13.7,9.9 v13.45,9.65 | v3.95,19.1 3.95,20.45 C4.1 3.81,21.26 4.15,21.6 4.7,21.6 5.1,22 5.1,26.42 v4.93,26.59 6.35,28.01 R3.1
  Route2 0.25: v13.45,9.65 12,9.65 4.55,17.1 4.55,18.5 v3.95,19.1 | v22.86,33.02 21.24,31.4 7.7,31.4 4.93,28.63 v4.93,26.59
RX0  (via drill 0.3 pad 0.5, 0.9 pad 1.7)
  Top 0.25: ATMEGA2560.2 9.85,24.55 v9.7,24.7 | v9.6,23.3 9.1,22.8 9.1,13.65 8.45,13 7.45,13 6.4,11.95 6.4,5.92 6.35,5.87 6.35,3.81 v5.08,2.54
  Bottom 0.25: v9.7,24.7 9.6,24.6 v9.6,23.3 7,20.7 3.7,20.7 2.05,19.05 v1.27,19.05
RX1  (via drill 0.9 pad 1.7)
  Top 0.25: ATMEGA2560.45 22.55,9.65 26.67,5.53 26.67,3.81 v27.94,2.54
RX2  (via drill 0.3 pad 0.5, 0.9 pad 1.7)
  Top 0.25: ATMEGA2560.12 12.75,19.55 14.35,21.15 15.1,21.15 15.6,20.65 15.6,17.35 16.15,16.8 16.15,13.15 15.95,12.95 v15.95,12.55 | v21.25,6.95 21.65,6.35 23.4,6.35 24.15,5.6 24.15,3.79 v25.4,2.54
  Bottom 0.25: 16,12.5 v15.95,12.55 | 15.95,12.45 v15.95,12.55 | v15.95,12.55 15.95,12 20.8,7.15 21.05,7.15 v21.25,6.95
RX3  (via drill 0.3 pad 0.5, 0.9 pad 1.7)
  Top 0.25: ATMEGA2560.63 26,19.05 25.85,18.9 25.85,17.95 v25.2,17.3
  Bottom 0.25: v25.2,17.3 25,17.3 24.65,16.95 24.65,16 23.65,15 23.65,6.25 24.1,5.8 24.11,5.8 24.15,5.76 24.15,3.83 v22.86,2.54
TX0  (via drill 0.3 pad 0.5, 0.9 pad 1.7)
  Top 0.25: v5.08,5.08 5.08,5.63 5.8,6.35 5.8,12.15 7.2,13.55 8.2,13.55 8.5,13.85 8.5,22.5 8.3,22.7 v8.3,23.1 9.25,24.05 ATMEGA2560.3
  Bottom 0.25: v8.3,23.1 2.78,23.1 v1.27,21.59
TX1  (via drill 0.9 pad 1.7)
  Top 0.25: v27.94,5.08 27.92,5.08 27.92,5.13 23.45,9.6 23.4,9.6 23.05,9.95 ATMEGA2560.46
TX2  (via drill 0.3 pad 0.5, 0.9 pad 1.7)
  Top 0.25: ATMEGA2560.13 13,19.05 13.35,19.4 13.55,19.4 14.2,20.05 v14.45,20.05 | v16.6,20.2 16.6,20.1 16.8,19.9 v16.8,12.55 | v22.25,7.15 23.6,7.15 25.4,5.35 v25.4,5.08
  Bottom 0.25: v14.45,20.05 14.6,20.2 v16.6,20.2 | v16.8,12.55 16.8,12.4 17,12.4 v22.25,7.15
TX3  (via drill 0.3 pad 0.5, 0.9 pad 1.7)
  Top 0.25: ATMEGA2560.64 25.4,19.55 25.2,19.35 v25.2,18.3
  Bottom 0.25: 22.8,5.14 v22.86,5.08 23.05,5.27 23.05,15.4 24.15,16.5 24.15,17.3 25.15,18.3 v25.2,18.3
VUSB  (via drill 0.9 pad 1.7)
  Top 0.8: v1.27,13.97 2.45,15.15 SCHOTTKY.A

### Text on the board
bPlace: Fuzzy Studio Inc. | Naked Mega Rev. I-b
tValues: A2 | A4 | A6 | A8 | A10 | A12 | A14 | REF | SS | MOS | 49 | 47 | A0 | 45 | A1 | A3 | A5 | A7 | A9 | A11 | A13 | A15 | RST | SCK | MIS | 48 | 43 | 44 | .1uF | 46 | 41 | 42 | 39 | 40 | DTR | 37 | 38 | TX | 35 | 36 | RX | 33 | 34 | GND | 31 | 32 | 5V | 29 | 30 | 27 | 28 | 22 | 25 | 26 | TX | 2 | 4 | 6 | 8 | 10 | 12 | TX3 | TX2 | TX1 | SDA | 5V | 24 | GND | RX | 3 | 5 | 7 | 9 | 11 | 13 | RX3 | RX2 | RX1 | SCL | 23